# Altium schematic sheet TELM0003_TempSense_BCR.SchDoc: Temperature Sensor Circuit
size A3; Engineer: A. SHAW; Organization: BLUEsat Project; Address1: Room 419; Address2: School of EE&T; Address3: UNSW, NSW 2052; Address4: Australia; DocumentNumber: TELM0003; SheetNumber: 1; SheetTotal: 1; Version: 1.0
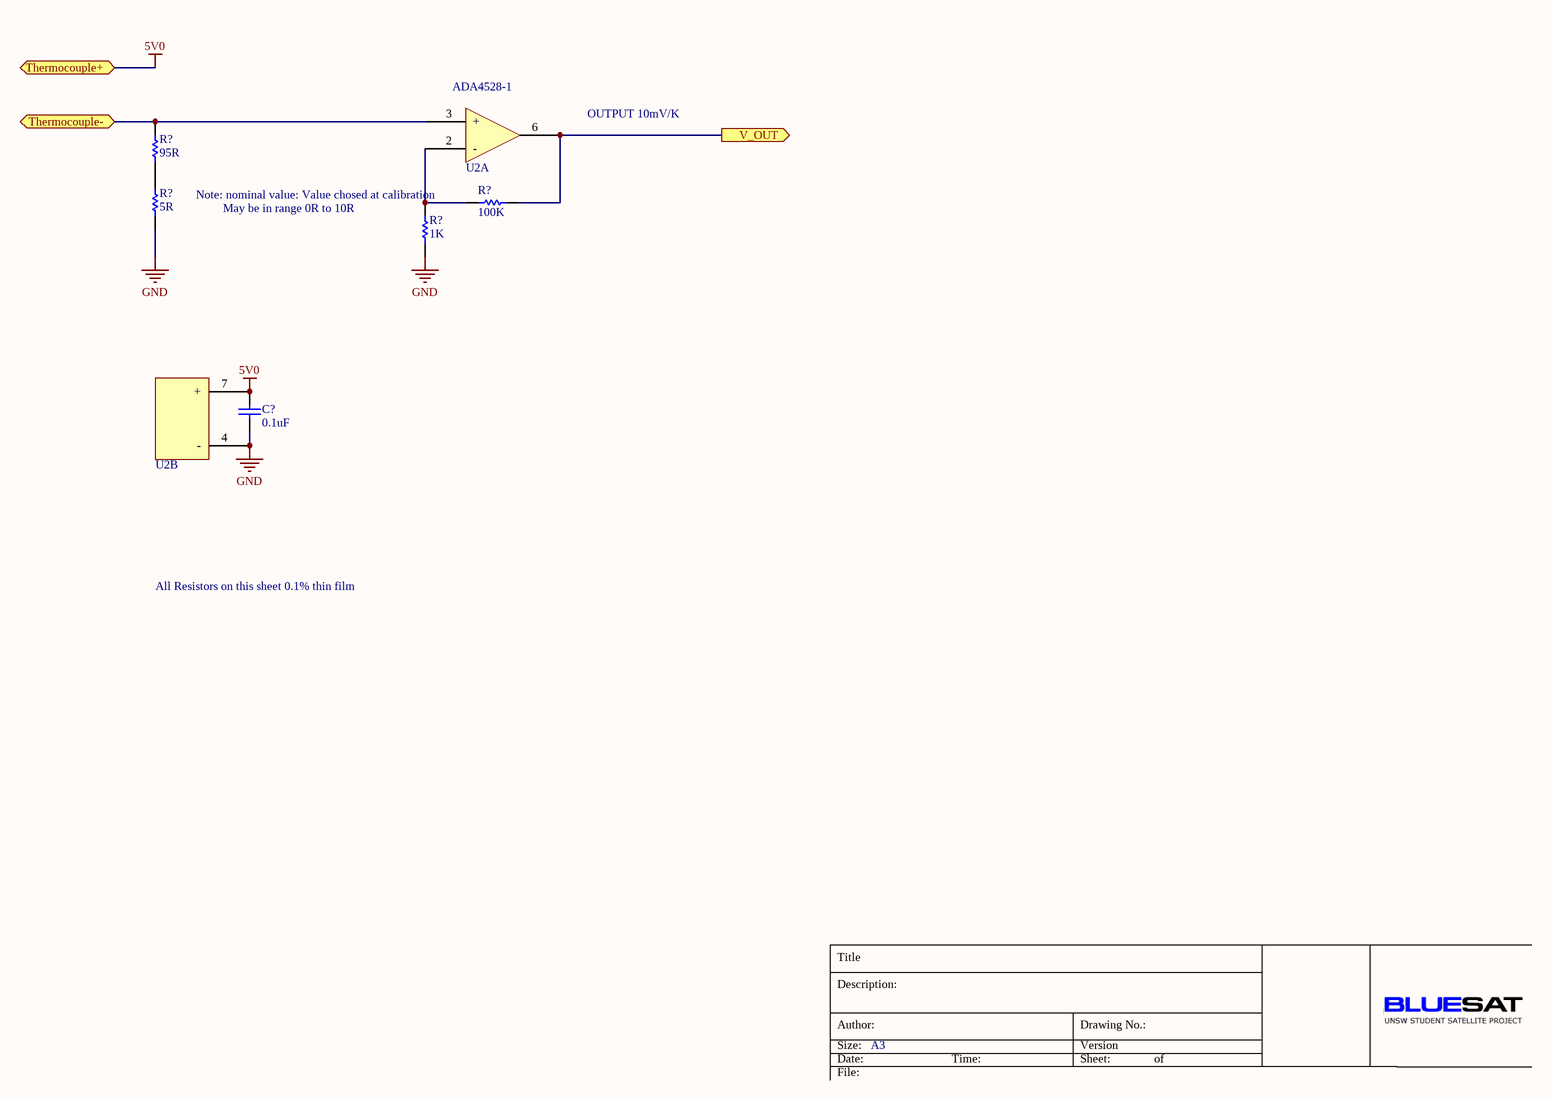
[diagram p0: TELM0003_TempSense_BCR.SchDoc]

## Parts
(Parts that share a designator on the sheet are numbered #1, #2 ... from top to bottom, then left to right.)
C?  value 0.1uF  [CAPC2012M]  (hidden comment: Cap)
R?#1  value 95R  [RESC2012M]  (hidden comment: 0805 Resistor)
R?#2  value 5R  [RESC2012M]  (hidden comment: 0805 Resistor)
R?#3  value 100K  [RESC2012M]  (hidden comment: 0805 Resistor)
R?#4  value 1K  [RESC2012M]  (hidden comment: 0805 Resistor)
U2  ADA4528-1  [SOIC8 - LME49720]  (parts A,B of 2)

## Ports
Thermocouple+, Thermocouple-, V_OUT (out)

## Nets
5V0: C?.1 U2.7(+) ; port Thermocouple+
GND: C?.2 R?#2.2 R?#4.2 U2.4(-)
Thermocouple-: R?#1.1 U2.3(+) ; port Thermocouple-
V_OUT: R?#3.2 U2.6(Out) ; port V_OUT
NetR?#1_2: R?#1.2 R?#2.1
NetR?#3_1: R?#3.1 R?#4.1 U2.2(-)

## Notes on the sheet
- OUTPUT 10mV/K
- (near R?#3) Note: nominal value: Value chosed at calibration
- (near R?#4) May be in range 0R to 10R
- All Resistors on this sheet 0.1% thin film
- Title
- Description:
- Size:
- Author:
- Date:
- A3
- Time:
- Version
- Sheet:
- Drawing No.:
- of
- File:

## Library data of the parts
C? = Cap: Capacitor; Published: 8-Jun-2000; LatestRevisionDate: 17-Jul-2002; LatestRevisionNote: Re-released for DXP Platform.; PackageReference: RAD-0.3; Publisher: Altium Limited; PackageDescription: Radial Cap, Thru-Hole; 2 Leads; 0.3 in Pin Spacing; Supplier 1: Farnell; Supplier 2: Farnell; Supplier Part Number 2: 1759265
R?#1-R?#4 = Res1: Resistor; Published: 8-Jun-2000; LatestRevisionDate: 17-Jul-2002; LatestRevisionNote: Re-released for DXP Platform.; PackageReference: AXIAL-0.3; Publisher: Altium Limited; PackageDescription: Axial Device, Thru-Hole; 2 Leads; 0.3 in Pin Spacing; Supplier 1: Farnell
U2 = ADA4528-1: Dual, High Performance Audio Operational Amplifier; ComponentLink1Description: Datasheet; ComponentLink1URL: http://www.national.com/ds/LM/LME49720.pdf